# EAGLE board snc98_Display_15x7-Seg_3-digit_LTD056 (EAGLE 6.6.0), part 1 of 2
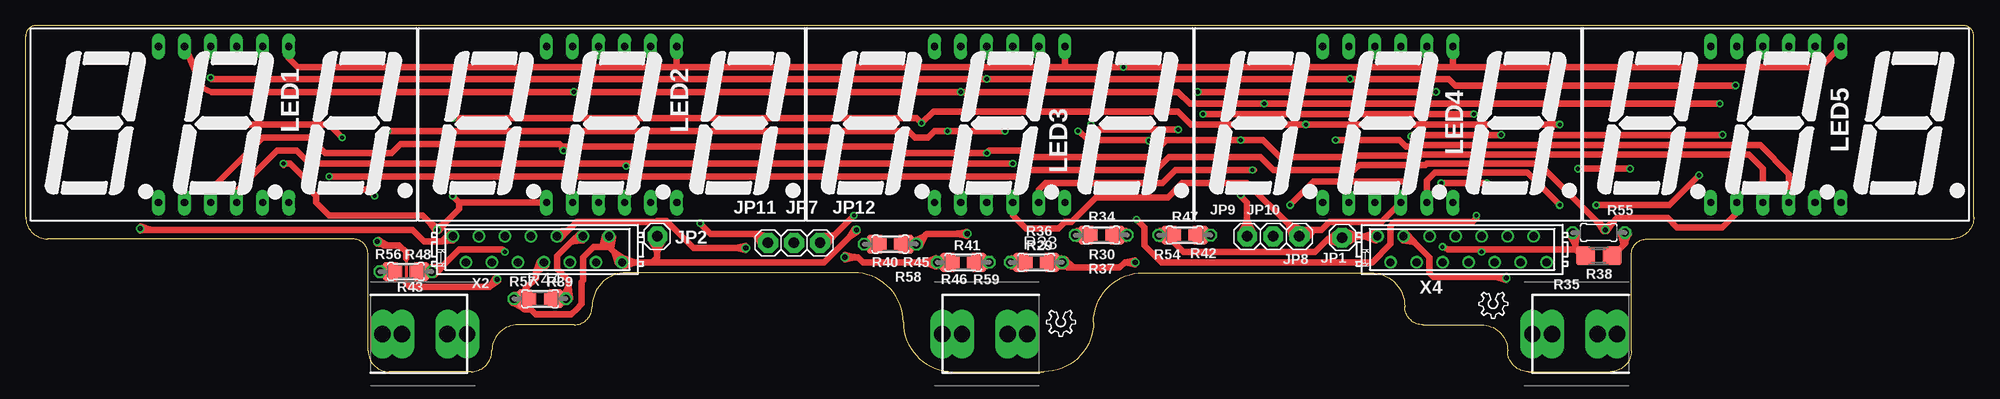
[diagram p2: board, top side]
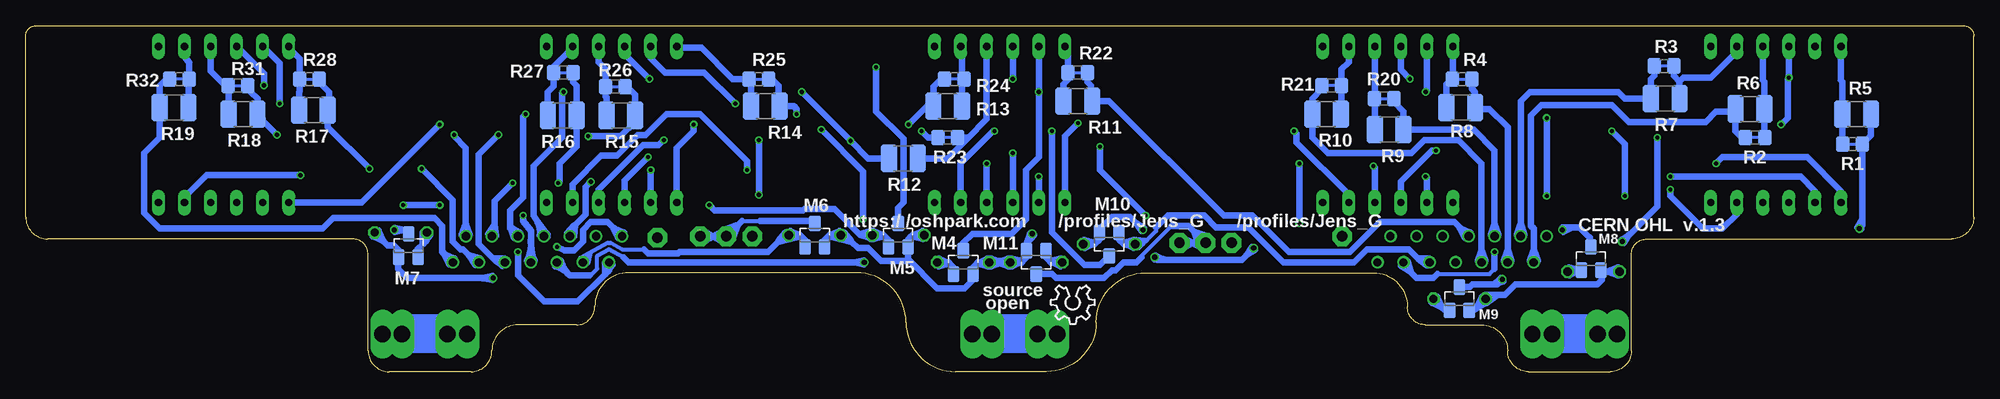
[diagram p3: board, bottom side, seen from below]

Size 189.99 x 33.78 mm. Coordinates in mm from the lower left corner, seen from the top.
Outline: 189.99,32.77 arc90 188.98,33.78 1.02,33.78 arc90 0,32.77 0,15.11 arc90 2.16,12.95 31.88,12.95 arc-90 33.4,11.43 33.4,2.03 arc90 35.43,0 43.43,0 arc90 45.47,2.03 arc-90 48.01,4.57 53.47,4.57 arc90 55.25,6.35 arc-90 58.55,9.65 80.77,9.65 arc-90 85.6,4.83 arc90 90.42,0 99.31,0 arc90 104.14,4.83 arc-90 108.97,9.65 131.19,9.65 arc-90 134.49,6.35 arc90 136.27,4.57 141.99,4.57 arc-90 144.53,2.03 arc90 146.56,0 154.56,0 arc90 156.59,2.03 156.59,11.43 arc-90 158.12,12.95 187.83,12.95 arc90 189.99,15.11 189.99,32.77
Copper layers (1*16): Top 0.035mm / dielectric 1.6mm / Bottom 0.035mm
Design rules "Elecrow_2-layer_PCB_eagle_rule": minimum track width 6mil, minimum drill 12mil, track to track 6mil, track to pad 6mil, pad to pad 6mil, via to via 8mil, smd to smd 0mil, copper to edge 20mil, drill to drill 10mil, minimum pad ring 6mil, minimum via ring 6mil, stop-mask expansion 0mil, vias tented up to drill 100mil, thermal gap 10mil

## Footprints (pad centres in the part's own frame; a part is rotated, then mirrored left to right if it is on the bottom)
BATTERY-AAA-LEFT = drill 1.6 long: P1 -2.413,0; P2 3.937,0; P3 2.032,0; P4 -4.318,0
BATTERY-AAA-RIGHT = drill 1.6 long: M1 -3.937,0; M2 2.413,0; M3 4.318,0; M4 -2.032,0
1X01 = drill 1.016 pad 1.93 octagon: 1 0,0
BX56-12 = drill 0.7 pad 1.27 long: 1 -6.35,-7.62; 2 -3.81,-7.62; 3 -1.27,-7.62; 4 1.27,-7.62; 5 3.81,-7.62; 6 6.35,-7.62; 7 6.35,7.62; 8 3.81,7.62; 9 1.27,7.62; 10 -1.27,7.62; 11 -3.81,7.62; 12 -6.35,7.62
SOT-23 = smd 1.143 x 1.524: 1 0.953,1.143; 2 -0.953,1.143; 3 0,-1.143
R0805 = smd 1.3 x 1.5: 1 -0.95,0; 2 0.95,0
R1210 = smd 1.6 x 2.7: 1 -1.4,0; 2 1.4,0
0204/5 = drill 0.813 octagon: 1 -2.54,0; 2 2.54,0
M0805 = smd 1.3 x 1.6: 1 -1.016,0; 2 1.016,0
R1206 = smd 1.6 x 1.803: 1 -1.422,0; 2 1.422,0
MICROMATCH-14 = drill 0.813: 1 8.255,-1.27; 2 6.985,1.27; 3 5.715,-1.27; 4 4.445,1.27; 5 3.175,-1.27; 6 1.905,1.27; 7 0.635,-1.27; 8 -0.635,1.27; 9 -1.905,-1.27; 10 -3.175,1.27; 11 -4.445,-1.27; 12 -5.715,1.27; 13 -6.985,-1.27; 14 -8.255,1.27

## Placement (x,y rotation side)
BH4  HOLDER_AAA_LEFT1  [BATTERY-AAA-LEFT]  151.26,3.68 0 top
BH5  HOLDER_AAA_LEFT1  [BATTERY-AAA-LEFT]  93.73,3.68 0 top
BH6  HOLDER_AAA_RIGHT  [BATTERY-AAA-RIGHT]  38.73,3.68 0 top
JP1  [1X01]  128.4,13.08 0 top
JP2  [1X01]  61.59,13.21 0 top
JP7  [1X01]  74.93,12.57 0 top
JP8  [1X01]  124.21,13.21 0 top
JP9  [1X01]  119.13,13.21 0 top
JP10  [1X01]  121.67,13.21 0 top
JP11  [1X01]  72.39,12.57 0 top
JP12  [1X01]  77.47,12.57 0 top
LED1  BC56-12SRWA  [BX56-12]  19.3,24.13 0 top
LED2  BC56-12SRWA  [BX56-12]  57.15,24.13 0 top
LED3  BC56-12SRWA  [BX56-12]  95,24.13 0 top
LED4  BC56-12SRWA  [BX56-12]  132.84,24.13 0 top
LED5  BC56-12SRWA  [BX56-12]  170.69,24.13 0 top
LOGO1  OSHW_LOGO_8MILX0150-NT  [OSHW_8X150_NOTEXT]  85.75,8.43 180 bottom
LOGO2  OSHW_LOGO_6MILX0100-NT  [OSHW_6X100_NOTEXT]  102.36,5.97 180 top
LOGO3  OSHW_LOGO_6MILX0100-NT  [OSHW_6X100_NOTEXT]  144.53,7.75 180 top
M4  IRLML2244  [SOT-23]  98.55,10.67 180 bottom
M5  IRLML2244  [SOT-23]  104.9,13.34 180 bottom
M6  IRLML2244  [SOT-23]  113.03,13.34 180 bottom
M7  IRLML2244  [SOT-23]  152.65,12.32 180 bottom
M8  IRLML2244  [SOT-23]  37.34,11.05 180 bottom
M9  IRLML2244  [SOT-23]  50.17,7.11 180 bottom
M10  IRLML2244  [SOT-23]  84.33,12.45 0 bottom
M11  IRLML2244  [SOT-23]  91.44,10.67 0 bottom
R1  22  [R0805]  11.81,22.23 0 bottom
R2  22  [R0805]  21.34,22.86 180 bottom
R3  22  [R0805]  30.23,29.84 180 bottom
R4  22  [R0805]  49.91,28.57 0 bottom
R5  22  [R1210]  11.43,25.15 0 bottom
R6  22  [R1210]  21.84,25.65 180 bottom
R7  22  [R1210]  30.1,26.67 180 bottom
R8  22  [R1210]  50.04,25.78 0 bottom
R9  22  [R1210]  57.02,23.62 0 bottom
R10  22  [R1210]  63.12,25.15 180 bottom
R11  22  [R1210]  87.38,26.42 0 bottom
R12  22  [R1210]  104.39,20.83 180 bottom
R13  22  [R1210]  100.08,25.91 180 bottom
R14  22  [R1210]  117.86,25.91 0 bottom
R15  22  [R1210]  131.95,25.02 0 bottom
R16  22  [R1210]  137.67,25.02 0 bottom
R17  22  [R1210]  161.93,25.53 0 bottom
R18  22  [R1210]  168.78,25.15 0 bottom
R19  22  [R1210]  175.51,25.78 180 bottom
R20  22  [R0805]  57.53,26.67 0 bottom
R21  22  [R0805]  62.61,27.94 180 bottom
R22  22  [R0805]  87.38,29.21 0 bottom
R23  22  [R0805]  100.08,22.86 180 bottom
R24  22  [R0805]  99.44,28.57 180 bottom
R25  22  [R0805]  118.49,28.57 0 bottom
R26  22  [R0805]  132.46,27.81 0 bottom
R27  22  [R0805]  137.54,29.21 0 bottom
R28  22  [R0805]  162.31,28.57 0 bottom
R29  3k3  [0204/5]  98.55,10.67 0 top
R30  3k3  [0204/5]  104.9,13.34 0 top
R31  22  [R0805]  169.29,27.94 0 bottom
R32  22  [R0805]  175.01,28.57 180 bottom
R33  3k3  [M0805]  98.55,10.67 0 top
R34  3k3  [M0805]  104.9,13.34 0 top
R35  3k3  [M0805]  153.42,11.3 0 top
R36  3k3  [R1206]  98.55,10.67 0 top
R37  3k3  [R1206]  104.9,13.34 0 top
R38  3k3  [R1206]  153.42,11.3 0 top
R39  3k3  [R1206]  50.17,7.11 0 top
R40  3k3  [R1206]  84.33,12.45 180 top
R41  3k3  [R1206]  91.44,10.67 180 top
R42  3k3  [R1206]  113.03,13.34 0 top
R43  3k3  [R1206]  37.08,9.78 0 top
R44  3k3  [M0805]  50.17,7.11 0 top
R45  3k3  [M0805]  84.33,12.45 180 top
R46  3k3  [M0805]  91.44,10.67 180 top
R47  3k3  [M0805]  113.03,13.34 0 top
R48  3k3  [M0805]  37.08,9.78 0 top
R54  3k3  [0204/5]  113.03,13.34 0 top
R55  3k3  [0204/5]  153.42,13.59 0 top
R56  3k3  [0204/5]  37.08,9.78 0 top
R57  3k3  [0204/5]  50.17,7.11 0 top
R58  3k3  [0204/5]  84.33,12.45 180 top
R59  3k3  [0204/5]  91.44,10.67 180 top
X2  MICROMATCH-14  [MICROMATCH-14]  49.91,11.94 180 top
X4  MICROMATCH-14  [MICROMATCH-14]  140.08,11.94 180 top

## Tracks (layer width: path | path; a pad name or v marks a point on that pad's centre or on a via)
CA_LED  (via drill 0.41, 0.51)
  Top 0.254: 49.28,7.62 48.84,7.21 48.76,7.13 | 48.76,7.13 R39.1 | R33.1 97.54,11.43 97.15,10.7 | 97.15,10.7 R36.1 | 103.5,13.3 103.89,12.7 R34.1 | 103.5,13.3 R37.1 | 97.15,10.7 arc-29 96.3,11.18 R29.1 96.33,10.18 arc-29 97.15,10.7 | 103.5,13.3 arc-29 102.67,13.83 R30.1 102.65,12.83 arc-29 103.5,13.3 | 48.76,7.13 arc-29 47.92,7.62 R57.1 47.93,6.62 arc-29 48.76,7.13
  Top 0.406: 53.72,6.22 53.72,6.1 | 124.84,11.81 124.84,11.68 | R47.1 111.63,13.34 | 111.63,13.34 111,13.34 111,13.35 111.14,13.49 | R35.1 R38.1 | R46.1 92.84,10.67 | 92.84,10.67 R59.1 | R45.1 85.73,12.45 | 85.73,12.45 R40.1 | R44.1 48.76,7.11 | 48.76,7.11 48.47,7.11 48.29,6.93 | R48.1 35.68,9.78 | 35.68,9.78 R56.1 | 111.63,13.34 arc-29 110.72,13.79 R54.1 110.72,12.88 arc-29 111.63,13.34 | 35.68,9.78 arc-29 34.77,10.23 R56.1 | 35.68,9.78 arc29 34.77,9.32 R56.1 | 48.76,7.11 arc-29 47.85,7.57 R57.1 47.85,6.66 arc-29 48.76,7.11 | 85.73,12.45 arc-29 86.64,11.99 R58.1 86.64,12.9 arc-29 85.73,12.45 | 92.84,10.67 arc-29 93.75,10.21 R59.1 | 92.84,10.67 arc29 93.75,11.12 R59.1
  Top 0.508: 47.76,7.55 48.84,7.21 48.76,7.17 | 48.76,7.17 48.29,6.93 47.83,6.7 | 47.76,7.55 arc29 48.76,7.23 arc29 47.85,6.71 R57.1 | R57.1 47.76,7.55 | 48.76,7.17 arc-29 47.79,7.54 R57.1 | 48.76,7.17 arc29 47.83,6.7 | R57.1 47.83,6.7
  Top 0.61: R43.1 R56.1 | 61.09,10.67 77.85,10.67 80.31,13.12 | 61.09,10.67 59.39,10.67 | 59.39,10.67 59.3,10.67 | 59.3,10.67 X2.14 | 80.31,13.12 80.34,13.16 | 80.34,13.16 v81.03,13.84 | R37.1 103.48,13.36 103.38,13.46 102.49,13.46 R30.1 | R54.1 111.23,13.31 R42.1 111.63,13.31 | 111.7,13.24 111.78,13.17 111.78,12.79 112.89,11.68 124.84,11.68 125.73,11.68 126.89,12.85 | 111.7,13.24 111.63,13.31 | 56.9,12.19 56.38,12.19 | 56.38,12.19 56.22,12.19 | 56.22,12.19 55.37,12.19 54.36,11.18 54.36,8.89 54.23,8.76 54.23,6.6 53.72,6.1 53.21,5.59 49.73,5.59 49.23,6.1 48.64,6.1 48.49,6.25 | X4.1 130.69,13.21 | 130.69,13.21 130.61,13.21 | 130.61,13.21 129.92,13.21 | 129.92,13.21 129.81,13.21 | 129.81,13.21 127.76,13.21 127.76,12.95 | JP2.1 61.59,11.79 | 61.59,11.79 61.59,11.68 | 61.59,11.68 61.59,11.18 61.09,10.67 | R58.1 R40.1 | R58.1 86.28,12.45 | 49.23,6.63 48.84,7.01 | 48.84,7.01 48.76,7.09 | 48.76,7.09 R39.1 | 48.64,7.21 R39.1 | R41.1 R59.1 | v91.82,13.46 90.86,13.46 | 90.86,13.46 90.8,13.46 | 90.8,13.46 87.88,13.46 87.73,13.31 | 87.73,13.31 87.67,13.25 | 87.67,13.25 R58.1 | R39.1 R57.1 | 48.49,6.25 48.43,6.31 | 48.43,6.31 R57.1 | v138.18,12.19 138.68,11.94 141.99,11.94 | 126.89,12.85 126.98,12.94 | 126.98,12.94 127,12.95 127.76,12.95 | 127.76,12.95 128.27,12.95 JP1.1 | X2.8 50.04,10.16 49.78,9.72 | 49.78,9.72 49.78,9.12 48.77,8.11 48.77,7.54 | 48.77,7.54 48.77,7.14 48.76,7.13 | 48.76,7.13 R39.1 | 141.99,11.94 151.13,11.94 | 151.13,11.94 151.38,11.68 151.61,11.68 R38.1 | 151.13,11.94 151.13,12.4 | 151.13,12.4 151.13,12.48 | 151.13,12.48 151.13,13.34 R55.1 | 56.9,12.19 X2.13 | X2.14 58.17,10.92 57.5,11.59 | 57.5,11.59 57.44,11.65 | 57.44,11.65 57.08,12 | 57.08,12 57.01,12.08
  Top 0.61: 57.01,12.08 56.9,12.19 | v141.99,11.68 141.99,11.94 | 80.31,13.12 80.35,13.15 | 80.35,13.15 81.14,13.67 | 80.31,13.12 80.34,13.17 | 80.34,13.17 80.86,13.96 | 90.8,13.46 90.86,13.45 | 90.86,13.45 91.78,13.26 | 90.8,13.46 91.78,13.66 | 111.7,13.24 111.14,13.49 110.66,13.71 | 111.7,13.24 111.62,13.21 | 111.62,13.21 110.59,12.94 | 151.13,12.4 151.14,12.48 | 151.14,12.48 151.28,13.54 | 151.13,12.4 151.09,12.47 | 151.09,12.47 150.53,13.38 | 49.78,9.72 50.76,10.32 | 49.78,9.72 50.16,10.8 | 130.61,13.21 131.69,12.82 | 130.61,13.21 130.69,13.24 | 130.69,13.24 131.69,13.59 | 59.39,10.67 59.3,10.7 | 59.3,10.7 58.3,11.05 | 59.39,10.67 58.3,10.29 | 57.44,11.65 57.78,10.55 | X2.14 57.78,10.55 | 57.44,11.65 58.39,11.01 | X2.14 58.39,11.01 | 56.22,12.19 56.29,12.24 | 56.29,12.24 57.14,12.88 | 56.22,12.19 56.24,12.28 | 56.24,12.28 56.5,13.31 | X2.13 56.5,13.31 | 57.08,12 57.1,12.09 | 57.1,12.09 57.3,13.13 | X2.13 57.3,13.13 | 57.08,12 57.04,12.08 | 57.04,12.08 56.54,13.02 | X2.13 56.54,13.02 | 129.92,13.21 129.81,13.25 | 129.81,13.25 128.63,13.7 | 128.63,13.7 | JP1.1 128.63,13.7 | 129.92,13.21 129.82,13.15 | 129.82,13.15 128.73,12.51 | 126.89,12.85 128.21,12.45 | 126.89,12.85 128.02,13.62 | 61.59,11.68 61.64,11.79 | 61.64,11.79 62.19,12.92 | JP2.1 62.19,12.92 | 61.59,11.68 61,12.92 | JP2.1 61,12.92 | 48.84,7.01 48.76,7.05 | 48.76,7.05 47.79,7.48 | 48.84,7.01 48.76,6.99 | 48.76,6.99 47.73,6.72 | 48.49,6.25 48.45,6.33 | 48.45,6.33 47.99,7.29 | 48.49,6.25 47.45,6.75 | 48.77,7.54 48.68,7.54 | 48.68,7.54 47.62,7.52 | 48.77,7.54 47.89,6.8 | 47.89,6.8 | R57.1 47.89,6.8 | 87.73,13.31 87.65,13.27 | 87.65,13.27 86.69,12.81 | 87.73,13.31 87.69,13.23 | 87.69,13.23 87.23,12.27 | 97.6,10.67 R33.1 97.15,10.67
  Top 0.61: 97.15,10.67 R36.1 R29.1 | 103.95,13.34 R34.1 103.5,13.34 | 103.5,13.34 R37.1 | R37.1 R30.1 | 80.34,13.16 arc-29 81.14,13.67 v81.03,13.84 | 80.34,13.16 arc29 80.86,13.95 v81.03,13.84 | 80.35,13.15 arc-29 81.14,13.67 | v81.03,13.84 81.14,13.67 | 80.35,13.15 arc29 80.85,13.95 v81.03,13.84 | 80.34,13.17 arc-29 81.13,13.67 v81.03,13.84 | 80.34,13.17 arc29 80.86,13.96 | v81.03,13.84 80.86,13.96 | 90.86,13.46 arc-29 91.78,13.26 v91.82,13.46 | 90.86,13.46 arc29 91.78,13.66 v91.82,13.46 | 90.86,13.45 arc-29 91.78,13.26 | v91.82,13.46 91.78,13.26 | 90.86,13.45 arc29 91.78,13.66 v91.82,13.46 | v91.82,13.46 91.78,13.26 arc29 90.86,13.47 arc29 91.78,13.66 | v91.82,13.46 91.78,13.66 | 97.15,10.67 arc-29 96.16,11.05 R29.1 | 97.15,10.67 arc29 96.16,10.29 R29.1 | 103.5,13.34 arc-29 102.51,13.71 R30.1 | 103.5,13.34 arc29 102.51,12.96 R30.1 | 111.63,13.31 arc-29 110.64,13.71 R54.1 | 111.63,13.31 arc29 110.63,12.95 R54.1 | 110.66,13.71 arc29 111.63,13.27 arc29 110.61,12.95 R54.1 | R54.1 110.66,13.71 | 111.62,13.21 arc-29 110.67,13.7 R54.1 | 111.62,13.21 arc29 110.59,12.94 | R54.1 110.59,12.94 | 151.13,12.48 arc-29 151.28,13.53 R55.1 | 151.13,12.48 arc29 150.54,13.36 R55.1 | 151.14,12.48 arc-29 151.28,13.54 | R55.1 151.28,13.54 | 151.14,12.48 arc29 150.54,13.36 R55.1 | 151.09,12.47 arc-29 151.28,13.52 R55.1 | 151.09,12.47 arc29 150.53,13.38 | R55.1 150.53,13.38 | X2.8 50.75,10.31 arc29 49.83,9.79 arc29 50.16,10.8 X2.8 | 50.76,10.32 arc29 49.86,9.76 arc29 50.16,10.78 X2.8 | X2.8 50.76,10.32 | X2.8 50.74,10.31 arc29 49.81,9.8 arc29 50.16,10.8 | X2.8 50.16,10.8 | 130.69,13.21 arc-29 131.68,12.83 X4.1 | 130.69,13.21 arc29 131.68,13.59 X4.1
  Top 0.61: 131.69,12.82 arc29 130.69,13.18 arc29 131.67,13.58 X4.1 | X4.1 131.69,12.82 | 130.69,13.24 arc-29 131.67,12.83 X4.1 | 130.69,13.24 arc29 131.69,13.59 | X4.1 131.69,13.59 | 59.3,10.67 arc-29 58.31,11.05 X2.14 | 59.3,10.67 arc29 58.31,10.29 X2.14 | 57.5,11.59 arc-29 57.77,10.56 X2.14 | 57.5,11.59 arc29 58.39,11.01 X2.14 | 59.3,10.7 arc-29 58.3,11.05 | X2.14 58.3,11.05 | 59.3,10.7 arc29 58.32,10.29 X2.14 | X2.14 58.32,11.04 arc29 59.3,10.64 arc29 58.3,10.29 | X2.14 58.3,10.29 | 57.78,10.55 arc29 57.47,11.56 arc29 58.38,11.02 X2.14 | X2.14 57.78,10.55 | X2.14 57.77,10.57 arc29 57.51,11.6 arc29 58.39,11.01 | X2.14 58.39,11.01 | 56.38,12.19 arc-29 57.17,12.91 X2.13 | 56.38,12.19 arc29 56.49,13.25 X2.13 | 57.01,12.08 arc-29 57.29,13.1 X2.13 | 57.01,12.08 arc29 56.53,13.03 X2.13 | 56.29,12.24 arc-29 57.14,12.88 | X2.13 57.14,12.88 | 56.29,12.24 arc29 56.5,13.29 X2.13 | 56.24,12.28 arc-29 57.12,12.87 X2.13 | 56.24,12.28 arc29 56.5,13.31 | X2.13 56.5,13.31 | 57.1,12.09 arc-29 57.3,13.13 | X2.13 57.3,13.13 | 57.1,12.09 arc29 56.55,13 X2.13 | 57.04,12.08 arc-29 57.29,13.11 X2.13 | 57.04,12.08 arc29 56.54,13.02 | X2.13 56.54,13.02 | 129.81,13.21 arc-29 128.65,13.69 JP1.1 | 129.81,13.21 arc29 128.75,12.53 JP1.1 | 126.98,12.94 arc-29 128.15,12.47 JP1.1 | 126.98,12.94 arc29 128.03,13.63 JP1.1 | 129.81,13.25 arc-29 128.63,13.7 | JP1.1 128.63,13.7 | 129.81,13.25 arc29 128.77,12.54 JP1.1 | 129.82,13.15 arc-29 128.68,13.68 JP1.1 | 129.82,13.15 arc29 128.73,12.51 | JP1.1 128.73,12.51 | 128.21,12.45 arc29 127,12.81 arc29 127.98,13.6 JP1.1 | JP1.1 128.21,12.45 | JP1.1 128.16,12.46 arc29 126.98,12.91 arc29 128.02,13.62 | JP1.1 128.02,13.62
  Top 0.61: 61.59,11.79 arc-29 62.18,12.9 JP2.1 | 61.59,11.79 arc29 61.01,12.9 JP2.1 | 61.64,11.79 arc-29 62.19,12.92 | JP2.1 62.19,12.92 | 61.64,11.79 arc29 61.02,12.88 JP2.1 | JP2.1 62.17,12.88 arc29 61.55,11.79 arc29 61,12.92 | JP2.1 61,12.92 | 48.76,7.09 arc-29 47.78,7.49 R57.1 | 48.76,7.09 arc29 47.76,6.73 R57.1 | 48.43,6.31 arc-29 48,7.28 R57.1 | 48.43,6.31 arc29 47.46,6.74 R57.1 | 48.76,7.13 arc-29 47.76,7.49 R57.1 | 48.76,7.13 arc29 47.78,6.74 R57.1 | 48.76,7.05 arc-29 47.79,7.48 | R57.1 47.79,7.48 | 48.76,7.05 arc29 47.75,6.72 R57.1 | 48.76,6.99 arc-29 47.81,7.47 R57.1 | 48.76,6.99 arc29 47.73,6.72 | R57.1 47.73,6.72 | 48.45,6.33 arc-29 47.99,7.29 | R57.1 47.99,7.29 | 48.45,6.33 arc29 47.47,6.74 R57.1 | R57.1 48,7.27 arc29 48.41,6.29 arc29 47.45,6.75 | R57.1 47.45,6.75 | 48.68,7.54 arc-29 47.62,7.52 | R57.1 47.62,7.52 | 48.68,7.54 arc29 47.9,6.81 R57.1 | R57.1 47.64,7.52 arc29 48.7,7.48 arc29 47.89,6.8 | R57.1 47.89,6.8 | 87.67,13.25 arc-29 86.7,12.82 R58.1 | 87.67,13.25 arc29 87.24,12.28 R58.1 | 87.65,13.27 arc-29 86.69,12.81 | R58.1 86.69,12.81 | 87.65,13.27 arc29 87.24,12.29 R58.1 | 87.69,13.23 arc-29 86.71,12.82 R58.1 | 87.69,13.23 arc29 87.23,12.27 | R58.1 87.23,12.27
  Bottom 0.254: M8.2 35.92,9.91 35.92,9.78
  Bottom 0.61: M8.2 36.27,9.7 36.27,8.94 36.7,8.51 44.7,8.51 45.72,7.49 46.47,7.49 | 46.47,7.49 46.55,7.49 | 46.55,7.49 47.24,7.49 R57.1 | 81.74,14.56 82.3,15.11 84.07,15.11 85.27,13.92 M10.2 85.27,12.93 85.65,12.54 | 81.74,14.56 81.71,14.53 | 81.71,14.53 v81.03,13.84 | 36.14,9.78 35.92,9.78 35.76,9.78 | 35.76,9.78 35.68,9.78 | 35.68,9.78 R56.1 | 97.23,10.57 97.61,10.19 M4.2 97.66,9.6 97.66,8.89 98.42,8.13 101.09,8.13 103.96,11 | 97.23,10.57 97.15,10.65 | 97.15,10.65 R36.1 R29.1 | 103.58,13.24 103.96,12.85 M5.2 103.96,12.31 103.96,11 | 103.58,13.24 103.5,13.31 | 103.5,13.31 R37.1 R30.1 | 111.45,13.28 R54.1 | 103.96,11 104.16,10.79 106.55,10.79 107.82,12.06 108.84,12.06 109.46,12.69 | R54.1 110.11,13.34 109.52,12.74 | 109.52,12.74 109.46,12.69 | v138.18,12.19 137.41,11.81 136.53,11.81 135.64,12.7 135.64,13.84 134.87,14.61 133.22,14.61 132.69,14.07 | v141.99,11.68 141.99,9.4 139.45,6.86 136.14,6.86 133.49,9.51 | R58.1 85.85,12.45 | M9.2 48.64,6.1 48.49,6.25 | 48.49,6.25 48.43,6.31 | 48.43,6.31 R57.1 | 85.65,12.54 85.73,12.47 | 85.73,12.47 R40.1 R58.1 | 92.77,10.77 92.38,11.15 M11.2 92.33,11.73 92.33,12.58 | 92.77,10.77 92.84,10.69 | 92.84,10.69 R41.1 R59.1 | 92.33,12.58 92.08,12.95 v91.82,13.46 | R59.1 94.79,10.67 | 94.79,10.67 94.87,10.67 | 94.87,10.67 95.12,10.67 | 95.12,10.67 95.2,10.67 | 95.2,10.67 R29.1 | X4.2 133.1,9.91 133.42,9.58 | 133.42,9.58 133.49,9.51 | 132.69,14.07 132.63,14.01 | 132.63,14.01 X4.1 | 151.64,11.3 M7.2 151.74,11.3 151.74,11.96 151.27,12.44 | M6.2 112.08,12.87 111.7,13.24 | 111.7,13.24 111.63,13.31 | 111.63,13.31 R42.1 R54.1 | 151.27,12.44 151.2,12.5 | 151.2,12.5 150.88,12.83 R55.1 | 81.74,14.56 80.91,14.01
  Bottom 0.61: 81.74,14.56 81.2,13.73 | 92.33,12.58 92.01,13.53 | v91.82,13.46 92.01,13.53 | 92.33,12.58 91.67,13.33 | v91.82,13.46 91.67,13.33 | 97.23,10.57 97.15,10.61 | 97.15,10.61 96.18,11.04 | 97.23,10.57 97.14,10.55 | 97.14,10.55 96.12,10.28 | 94.79,10.67 95.11,10.55 | 95.11,10.55 95.88,10.29 | 94.79,10.67 94.87,10.7 | 94.87,10.7 95.11,10.78 | 95.11,10.78 95.88,11.05 | 103.58,13.24 103.5,13.27 | 103.5,13.27 102.53,13.71 | 103.58,13.24 103.49,13.21 | 103.49,13.21 102.47,12.94 | 109.46,12.69 110.58,12.94 | R54.1 110.58,12.94 | 109.46,12.69 109.51,12.75 | 109.51,12.75 110.17,13.59 | R54.1 110.17,13.59 | 111.7,13.24 111.63,13.27 | 111.63,13.27 110.66,13.71 | 111.7,13.24 111.62,13.21 | 111.62,13.21 110.59,12.94 | 151.27,12.44 151.27,12.52 | 151.27,12.52 151.28,13.58 | R55.1 151.28,13.58 | 151.27,12.44 150.56,13.34 | R55.1 150.56,13.34 | 35.76,9.78 35.68,9.81 | 35.68,9.81 34.68,10.16 | 35.76,9.78 34.68,9.4 | 132.69,14.07 132.61,14.03 | 132.61,14.03 131.65,13.57 | 132.69,14.07 132.65,13.99 | 132.65,13.99 132.19,13.03 | 133.49,9.51 133.49,9.6 | 133.49,9.6 133.5,10.66 | X4.2 133.5,10.66 | 133.49,9.51 132.78,10.42 | X4.2 132.78,10.42 | 46.47,7.49 46.53,7.44 | 46.53,7.44 47.38,6.79 | 47.38,6.79 | R57.1 47.38,6.79 | 46.47,7.49 47.61,7.52 | 47.61,7.52 47.62,7.52 | 48.49,6.25 48.45,6.33 | 48.45,6.33 47.99,7.29 | 48.49,6.25 47.45,6.75 | 85.65,12.54 86.7,12.07 | 85.65,12.54 85.74,12.57 | 85.74,12.57 86.76,12.84 | 92.77,10.77 93.81,10.3 | 92.77,10.77 92.85,10.79 | 92.85,10.79 93.88,11.06 | 95.2,10.67 95.12,10.7 | 95.12,10.7 94.88,10.78 | 94.88,10.78 94.11,11.05 | 95.2,10.67 94.88,10.55 | 94.88,10.55 94.11,10.29 | 81.71,14.53 arc-29 80.92,14.01 v81.03,13.84 | 81.71,14.53 arc29 81.2,13.73 v81.03,13.84
  Bottom 0.61: 80.91,14.01 arc29 81.7,14.53 arc29 81.2,13.73 v81.03,13.84 | v81.03,13.84 80.91,14.01 | v81.03,13.84 80.92,14.02 arc29 81.72,14.52 arc29 81.2,13.73 | v81.03,13.84 81.2,13.73 | v91.82,13.46 92.02,13.52 arc29 92.3,12.62 arc29 91.67,13.33 v91.82,13.46 | 92.01,13.53 arc29 92.31,12.63 arc29 91.67,13.32 v91.82,13.46 | v91.82,13.46 92.01,13.53 | v91.82,13.46 92.02,13.52 arc29 92.3,12.62 arc29 91.67,13.33 | v91.82,13.46 91.67,13.33 | 97.15,10.65 arc-29 96.16,11.04 R29.1 | 97.15,10.65 arc29 96.15,10.29 R29.1 | 94.87,10.67 arc-29 95.87,10.29 R29.1 | 94.87,10.67 arc29 95.87,11.05 R29.1 | 97.15,10.61 arc-29 96.18,11.04 | R29.1 96.18,11.04 | 97.15,10.61 arc29 96.14,10.28 R29.1 | 97.14,10.55 arc-29 96.2,11.03 R29.1 | 97.14,10.55 arc29 96.12,10.28 | R29.1 96.12,10.28 | 95.88,10.29 arc29 94.87,10.64 arc29 95.86,11.04 R29.1 | R29.1 95.88,10.29 | 94.87,10.7 arc-29 95.86,10.29 R29.1 | 94.87,10.7 arc29 95.88,11.05 | R29.1 95.88,11.05 | 94.88,10.78 arc-29 95.83,10.3 R29.1 | 94.88,10.78 arc29 95.91,11.06 R29.1 | 94.88,10.55 arc-29 95.91,10.28 R29.1 | 94.88,10.55 arc29 95.83,11.03 R29.1 | 103.5,13.31 arc-29 102.51,13.71 R30.1 | 103.5,13.31 arc29 102.5,12.95 R30.1 | 103.5,13.27 arc-29 102.53,13.71 | R30.1 102.53,13.71 | 103.5,13.27 arc29 102.49,12.95 R30.1 | 103.49,13.21 arc-29 102.55,13.7 R30.1 | 103.49,13.21 arc29 102.47,12.94 | R30.1 102.47,12.94 | 109.52,12.74 arc-29 110.56,12.94 R54.1 | 109.52,12.74 arc29 110.17,13.58 R54.1 | 111.63,13.31 arc-29 110.64,13.71 R54.1 | 111.63,13.31 arc29 110.63,12.95 R54.1 | 110.58,12.94 arc29 109.54,12.7 arc29 110.16,13.57 R54.1 | R54.1 110.58,12.94 | 109.51,12.75 arc-29 110.56,12.94 R54.1
  Bottom 0.61: 109.51,12.75 arc29 110.17,13.59 | R54.1 110.17,13.59 | 111.63,13.27 arc-29 110.66,13.71 | R54.1 110.66,13.71 | 111.63,13.27 arc29 110.61,12.95 R54.1 | 111.62,13.21 arc-29 110.67,13.7 R54.1 | 111.62,13.21 arc29 110.59,12.94 | R54.1 110.59,12.94 | 151.2,12.5 arc-29 151.28,13.56 R55.1 | 151.2,12.5 arc29 150.55,13.34 R55.1 | 151.27,12.52 arc-29 151.28,13.58 | R55.1 151.28,13.58 | 151.27,12.52 arc29 150.57,13.32 R55.1 | R55.1 151.28,13.56 arc29 151.22,12.5 arc29 150.56,13.34 | R55.1 150.56,13.34 | 35.68,9.78 arc-29 34.69,10.16 R56.1 | 35.68,9.78 arc29 34.69,9.4 R56.1 | 35.68,9.81 arc-29 34.68,10.16 | R56.1 34.68,10.16 | 35.68,9.81 arc29 34.7,9.4 R56.1 | R56.1 34.7,10.15 arc29 35.68,9.75 arc29 34.68,9.4 | R56.1 34.68,9.4 | 132.63,14.01 arc-29 131.66,13.58 X4.1 | 132.63,14.01 arc29 132.2,13.04 X4.1 | 132.61,14.03 arc-29 131.65,13.57 | X4.1 131.65,13.57 | 132.61,14.03 arc29 132.2,13.05 X4.1 | 132.65,13.99 arc-29 131.67,13.58 X4.1 | 132.65,13.99 arc29 132.19,13.03 | X4.1 132.19,13.03 | 133.42,9.58 arc-29 133.5,10.64 X4.2 | 133.42,9.58 arc29 132.77,10.42 X4.2 | 133.49,9.6 arc-29 133.5,10.66 | X4.2 133.5,10.66 | 133.49,9.6 arc29 132.79,10.4 X4.2 | X4.2 133.5,10.64 arc29 133.44,9.58 arc29 132.78,10.42 | X4.2 132.78,10.42 | 46.55,7.49 arc-29 47.36,6.8 | R57.1 47.36,6.8 | 46.55,7.49 arc29 47.61,7.52 | R57.1 47.61,7.52 | 48.43,6.31 arc-29 48,7.28 R57.1 | 48.43,6.31 arc29 47.46,6.74 R57.1 | 46.53,7.44 arc-29 47.38,6.79 | R57.1 47.38,6.79 | 46.53,7.44 arc29 47.59,7.52 R57.1 | 47.36,6.8 arc29 46.55,7.5 arc29 47.62,7.52 | R57.1 47.36,6.8 | R57.1 47.62,7.52 | 48.45,6.33 arc-29 47.99,7.29 | R57.1 47.99,7.29 | 48.45,6.33 arc29 47.47,6.74 R57.1 | R57.1 48,7.27 arc29 48.41,6.29 arc29 47.45,6.75
  Bottom 0.61: R57.1 47.45,6.75 | 85.73,12.47 arc-29 86.72,12.07 R58.1 | 85.73,12.47 arc29 86.73,12.83 R58.1 | 86.7,12.07 arc29 85.73,12.51 arc29 86.74,12.83 R58.1 | R58.1 86.7,12.07 | 85.74,12.57 arc-29 86.68,12.08 R58.1 | 85.74,12.57 arc29 86.76,12.84 | R58.1 86.76,12.84 | 92.84,10.69 arc-29 93.83,10.29 R59.1 | 92.84,10.69 arc29 93.84,11.05 R59.1 | 95.12,10.67 arc-29 94.12,11.05 R59.1 | 95.12,10.67 arc29 94.12,10.29 R59.1 | 95.11,10.55 arc-29 94.16,11.03 R59.1 | 95.11,10.55 arc29 94.09,10.28 R59.1 | 95.11,10.78 arc-29 94.09,11.06 R59.1 | 95.11,10.78 arc29 94.16,10.3 R59.1 | 93.81,10.3 arc29 92.84,10.73 arc29 93.86,11.05 R59.1 | R59.1 93.81,10.3 | 92.85,10.79 arc-29 93.8,10.31 R59.1 | 92.85,10.79 arc29 93.88,11.06 | R59.1 93.88,11.06 | 95.12,10.7 arc-29 94.11,11.05 | R59.1 94.11,11.05 | 95.12,10.7 arc29 94.13,10.29 R59.1 | R59.1 94.13,11.04 arc29 95.12,10.64 arc29 94.11,10.29 | R59.1 94.11,10.29
D0_A  (via drill 0.51)
  Top 0.406: 41.4,12.95 41.53,12.95
  Top 0.61: 12.18,13.84 37.72,13.84 38.86,12.7 40.51,12.7 | 12.18,13.84 12.13,13.84 | 12.13,13.84 11.3,13.84 v11.18,13.97 | X2.1 41.78,13.21 41.53,12.95 40.51,12.7 | 40.55,12.7 40.51,12.7 | 12.18,13.84 11.24,14.16 | 11.24,14.16 | v11.18,13.97 11.24,14.16 | 12.18,13.84 12.13,13.84 | 12.13,13.84 11.19,13.77 | 40.55,12.7 41.69,12.8 | 40.55,12.7 40.61,12.76 | 40.61,12.76 41.37,13.5 | 12.13,13.84 arc-29 11.25,14.16 | v11.18,13.97 11.25,14.16 | 12.13,13.84 arc29 11.19,13.77 v11.18,13.97 | 11.24,14.16 arc29 12.13,13.86 arc29 11.2,13.77 v11.18,13.97 | v11.18,13.97 11.24,14.16 | 12.13,13.84 arc-29 11.25,14.16 | v11.18,13.97 11.25,14.16 | 12.13,13.84 arc29 11.19,13.77 | v11.18,13.97 11.19,13.77 | X2.1 41.69,12.8 arc29 40.62,12.73 arc29 41.36,13.49 X2.1 | 41.69,12.8 arc29 40.63,12.71 arc29 41.36,13.48 X2.1 | X2.1 41.69,12.8 | 40.61,12.76 arc-29 41.67,12.8 X2.1 | 40.61,12.76 arc29 41.37,13.5 | X2.1 41.37,13.5
  Bottom 0.61: R5.2 10.03,23.06 R1.2 10.86,14.94 | 10.86,14.94 10.86,14.88 | 10.86,14.88 10.86,14.29 v11.18,13.97 | 10.86,14.94 10.97,13.95 | 10.86,14.94 10.89,14.89 | 10.89,14.89 11.35,14.07 | 10.86,14.88 arc-29 10.97,13.95 v11.18,13.97 | 10.86,14.88 arc29 11.35,14.07 v11.18,13.97 | 10.97,13.95 arc29 10.87,14.88 arc29 11.35,14.07 v11.18,13.97 | v11.18,13.97 10.97,13.95 | 10.89,14.89 arc-29 10.97,13.95 v11.18,13.97 | 10.89,14.89 arc29 11.35,14.07 | v11.18,13.97 11.35,14.07
D1_A
  Bottom 0.61: 42.93,11.89 42.93,13.97 43.18,14.22 43.18,25.02 42.16,26.04 35.31,26.04 33.66,24.38 26.16,24.38 25.15,25.4 23.5,25.4 R6.2 23.24,25.02 23.24,23.5 22.61,22.86 R2.2 | 42.93,11.89 42.93,11.81 | 42.93,11.81 X2.2 | 42.93,11.89 42.54,10.8 | 42.93,11.89 42.95,11.81 | 42.95,11.81 43.31,10.8 | 42.93,11.81 arc-29 42.55,10.81 X2.2 | 42.93,11.81 arc29 43.31,10.81 X2.2 | 42.54,10.8 arc29 42.9,11.81 arc29 43.3,10.82 X2.2 | X2.2 42.54,10.8 | 42.95,11.81 arc-29 42.55,10.82 X2.2 | 42.95,11.81 arc29 43.31,10.8 | X2.2 43.31,10.8
D2_A
  Bottom 0.61: R7.2 31.5,26.03 | X2.3 44.2,14.35 | 44.2,14.35 44.2,14.43 | 44.2,14.43 44.2,26.42 43.31,27.3 34.67,27.3 34.04,26.67 R7.2 | R3.2 31.18,28.89 31.5,28.57 R7.2 | 44.2,14.43 43.81,13.34 | 44.2,14.43 44.23,14.35 | 44.23,14.35 44.58,13.34 | 44.2,14.35 arc-29 43.82,13.35 X2.3 | 44.2,14.35 arc29 44.58,13.35 X2.3 | 43.81,13.34 arc29 44.17,14.35 arc29 44.57,13.36 X2.3 | X2.3 43.81,13.34 | 44.23,14.35 arc-29 43.82,13.36 X2.3 | 44.23,14.35 arc29 44.58,13.34 | X2.3 44.58,13.34
D3_A
  Bottom 0.61: 45.47,11.89 45.47,23.88 47.24,25.65 48.51,25.65 R8.2 | 45.47,11.89 45.47,11.81 | 45.47,11.81 X2.4 | R8.2 48.64,25.4 | R4.2 48.96,27.62 48.64,27.3 R8.2 | 45.47,11.89 45.08,10.8 | 45.47,11.89 45.5,11.81 | 45.5,11.81 45.85,10.8 | 45.47,11.81 arc-29 45.09,10.81 X2.4 | 45.47,11.81 arc29 45.85,10.81 X2.4 | 45.08,10.8 arc29 45.44,11.81 arc29 45.84,10.82 X2.4 | X2.4 45.08,10.8 | 45.5,11.81 arc-29 45.09,10.82 X2.4 | 45.5,11.81 arc29 45.85,10.8 | X2.4 45.85,10.8
D4_A
  Bottom 0.61: X2.5 46.74,14.35 | 46.74,14.35 46.74,14.43 | 46.74,14.43 46.74,21.59 48.77,23.62 R9.2 55.63,25.4 56.58,26.36 R20.2 | 46.74,14.43 46.35,13.34 | 46.74,14.43 46.77,14.35 | 46.77,14.35 47.12,13.34 | 46.74,14.35 arc-29 46.36,13.35 X2.5 | 46.74,14.35 arc29 47.12,13.35 X2.5 | 46.35,13.34 arc29 46.71,14.35 arc29 47.11,13.36 X2.5 | X2.5 46.35,13.34 | 46.77,14.35 arc-29 46.36,13.36 X2.5 | 46.77,14.35 arc29 47.12,13.34 | X2.5 47.12,13.34
D5_A
  Bottom 0.61: X2.6 48.01,11.81 | 48.01,11.81 48.01,11.89 | 48.01,11.89 48.01,20.32 50.29,22.61 53.59,22.61 54.86,21.34 62.99,21.34 64.52,22.86 R10.2 64.52,26.67 63.56,27.62 R21.2 | 48.01,11.89 47.62,10.8 | 48.01,11.89 48.03,11.81 | 48.03,11.81 48.39,10.8 | 48.01,11.81 arc-29 47.63,10.81 X2.6 | 48.01,11.81 arc29 48.39,10.81 X2.6 | 47.62,10.8 arc29 47.98,11.81 arc29 48.38,10.82 X2.6 | X2.6 47.62,10.8 | 48.03,11.81 arc-29 47.63,10.82 X2.6 | 48.03,11.81 arc29 48.39,10.8 | X2.6 48.39,10.8
D6_A
  Bottom 0.61: R22.2 86.43,28.26 86.11,27.94 86.11,26.55 R11.2 84.33,26.42 73.15,15.24 70.36,15.24 66.8,11.68 60.83,11.68 57.91,14.61 50.67,14.61 50.14,14.07 | 50.14,14.07 50.08,14.01 | 50.08,14.01 X2.7 | 50.14,14.07 50.06,14.03 | 50.06,14.03 49.1,13.57 | 50.14,14.07 50.1,13.99 | 50.1,13.99 49.64,13.03 | 50.08,14.01 arc-29 49.11,13.58 X2.7 | 50.08,14.01 arc29 49.65,13.04 X2.7 | 50.06,14.03 arc-29 49.1,13.57 | X2.7 49.1,13.57 | 50.06,14.03 arc29 49.65,13.05 X2.7 | 50.1,13.99 arc-29 49.12,13.58 X2.7 | 50.1,13.99 arc29 49.64,13.03 | X2.7 49.64,13.03
D7_A  (via drill 0.41)
  Top 0.61: v137.54,27.3 v114.3,27.3 | v102.62,23.5 102.74,23.5 103.63,22.61 109.47,22.61 v109.54,22.54
  Bottom 0.61: v114.3,27.3 v109.54,22.54 107.82,20.83 R12.2 | R23.2 101.98,22.86 v102.62,23.5 | X4.7 139.19,13.46 140.07,14.59 | 140.07,14.59 140.46,15.24 140.46,20.07 137.67,22.86 137.67,27.18 v137.54,27.3 | X4.7 139.09,13.15 | X4.7 139.84,13.28 X4.7 | 140.07,14.59 arc-29 139.08,13.39 X4.7 | 140.07,14.59 arc29 139.84,13.31 X4.7 | X4.7 139.09,13.4 | X4.7 139.84,13.3 | X4.7 139.1,13.42
D8_A  (via drill 0.41)
  Top 0.61: v108.33,14.86 109.09,14.1 109.09,12.32 110.74,10.67 131.32,10.67 133.1,12.45 133.1,14.22 133.48,14.61 141.1,14.61 141.48,14.99 v141.48,15.24 | v112.39,23.62 104.39,23.62 v103.89,24.13
  Bottom 0.61: v108.33,14.86 108.33,19.56 v112.39,23.62 | v103.89,24.13 102.11,25.91 R13.2 101.48,27.81 100.71,28.57 R24.2 | X4.8 140.72,11.38 | 140.72,11.38 140.72,13.08 | 140.72,13.08 140.72,13.72 141.48,14.73 v141.48,15.24 | 140.72,11.38 140.33,10.8 | 140.72,11.38 140.75,11.55 | 140.75,11.55 141.1,10.8 | 140.72,13.08 arc-29 140.34,10.81 X4.8 | 140.72,13.08 arc29 141.1,10.81 X4.8 | 140.33,10.8 arc29 140.69,11.81 arc29 141.09,10.82 X4.8 | X4.8 140.33,10.8 | 140.75,11.55 arc-29 140.34,10.82 X4.8 | 140.75,11.55 arc29 141.1,10.8 | X4.8 141.1,10.8
D9_A  (via drill 0.41)
  Top 0.61: v141.22,25.15 v114.81,25.15
  Bottom 0.61: R14.2 116.46,25.78 | v114.81,25.15 114.81,25.65 115.06,25.91 R14.2 | R25.2 117.22,28.57 116.59,27.94 116.59,26.04 R14.2 | v141.22,25.15 141.48,24.89 141.48,17.02 142.75,15.75 142.75,14.16 | X4.9 142.75,13.97 142.75,14.05 | 142.75,14.16 142.75,14.05 | 142.75,14.16 142.67,14.11 | 142.67,14.11 141.77,13.55 | 142.75,14.16 142.72,14.08 | 142.72,14.08 142.37,13.07 | 142.75,14.05 arc-29 141.8,13.57 X4.9 | 142.75,14.05 arc29 142.37,13.06 X4.9 | 142.67,14.11 arc-29 141.77,13.55 | X4.9 141.77,13.55 | 142.67,14.11 arc29 142.38,13.09 X4.9 | 142.72,14.08 arc-29 141.79,13.56 X4.9 | 142.72,14.08 arc29 142.37,13.07 | X4.9 142.37,13.07
D10_A  (via drill 0.41)
  Top 0.61: v143.89,23.11 135.25,23.11 v135.13,22.99
  Bottom 0.61: R26.2 131.32,27.81 130.55,27.05 R15.2 130.55,24.39 131.95,22.99 v135.13,22.99 | X4.10 143.76,10.67 144.35,11 | 144.35,11 144.16,10.81 | 144.35,11 145.8,12.45 145.8,21.21 v143.89,23.11 | 144.16,10.81 144.32,11.06 | 144.32,11.06 143.26,11.07 | X4.10 143.26,11.07 | 144.16,10.81 143.51,10.35 | X4.10 143.51,10.35 | 144.35,11 arc-29 143.29,11.07 X4.10 | 144.35,11 arc29 143.5,10.35 X4.10 | 144.32,11.06 arc-29 143.26,11.07 | X4.10 143.26,11.07 | 144.32,11.06 arc29 143.52,10.36 X4.10 | X4.10 143.28,11.07 arc29 144.34,11.01 arc29 143.51,10.35 | X4.10 143.51,10.35
D11_A  (via drill 0.41)
  Top 0.61: v142.49,18.41 v138.05,18.41
  Bottom 0.61: R27.2 136.59,28.26 136.27,27.94 R16.2 | R16.2 | R16.2 136.27,21.97 137.92,20.32 137.92,18.54 v138.05,18.41 | v142.49,18.41 144.27,16.64 144.27,14.4 | 144.27,14.4 144.27,14.32 | 144.27,14.32 144.27,13.46 X4.11 | 144.27,14.4 144.26,14.31 | 144.26,14.31 144.12,13.26 | 144.27,14.4 144.32,14.33 | 144.32,14.33 144.87,13.42 | 144.27,14.32 arc-29 144.12,13.27 X4.11 | 144.27,14.32 arc29 144.86,13.43 X4.11 | 144.26,14.31 arc-29 144.12,13.26 | X4.11 144.12,13.26 | 144.26,14.31 arc29 144.86,13.44 X4.11 | 144.32,14.33 arc-29 144.13,13.28 X4.11 | 144.32,14.33 arc29 144.87,13.42 | X4.11 144.87,13.42
D12_A  (via drill 0.41)
  Top 0.61: v151.38,19.81 v156.46,19.81
  Bottom 0.61: R28.2 161.36,28.26 160.4,27.3 160.4,25.65 R17.2 160.53,23.87 v156.46,19.81 | X4.12 146.05,10.67 146.72,11.34 | 146.72,11.34 146.78,11.39 | 146.78,11.39 147.32,11.94 147.57,11.94 148.34,12.7 148.34,16.76 v151.38,19.81 | 146.78,11.39 146.69,11.37 | 146.69,11.37 145.68,11.06 | X4.12 145.68,11.06 | 146.78,11.39 146.13,10.44 | 146.72,11.34 arc-29 145.69,11.06 X4.12 | 146.72,11.34 arc29 146.14,10.45 X4.12 | 146.69,11.37 arc-29 145.68,11.06 | X4.12 145.68,11.06 | 146.69,11.37 arc29 146.14,10.46 X4.12 | X4.12 145.7,11.06 arc29 146.73,11.32 arc29 146.13,10.44 | X4.12 146.13,10.44
D13_A  (via drill 0.41)
  Top 0.61: v148.21,23.11 v165.48,23.11
  Bottom 0.61: R18.2 167.26,25.15 | 166.88,24.64 R18.2 | X4.13 147.07,14.35 | 147.07,14.35 147.07,14.43 | 147.07,14.43 147.07,21.84 148.21,22.99 v148.21,23.11 | R31.2 168.02,27.94 168.02,27.3 167.39,26.67 R18.2 | R18.2 167.39,24.77 167.13,24.77 v165.48,23.11 | 147.07,14.43 146.68,13.34 | 147.07,14.43 147.09,14.35 | 147.09,14.35 147.45,13.34 | 147.07,14.35 arc-29 146.69,13.35 X4.13 | 147.07,14.35 arc29 147.45,13.35 X4.13 | 146.68,13.34 arc29 147.04,14.35 arc29 147.44,13.36 X4.13 | X4.13 146.68,13.34 | 147.09,14.35 arc-29 146.69,13.36 X4.13 | 147.09,14.35 arc29 147.45,13.34 | X4.13 147.45,13.34
D14_A
  Bottom 0.61: R32.2 176.28,28.57 176.91,27.94 R19.2 176.91,22.86 178.44,21.34 178.44,15.49 176.91,13.97 161.04,13.97 160.02,14.99 150.11,14.99 149.35,14.22 149.35,11.68 149.2,11.53 | 149.2,11.53 149.14,11.47 | 149.14,11.47 X4.14 | 149.2,11.53 149.12,11.49 | 149.12,11.49 148.16,11.04 | 149.2,11.53 149.16,11.45 | 149.16,11.45 148.7,10.49 | 149.14,11.47 arc-29 148.17,11.04 X4.14 | 149.14,11.47 arc29 148.71,10.5 X4.14 | 149.12,11.49 arc-29 148.16,11.04 | X4.14 148.16,11.04 | 149.12,11.49 arc29 148.71,10.51 X4.14 | 149.16,11.45 arc-29 148.18,11.04 X4.14 | 149.16,11.45 arc29 148.7,10.49 | X4.14 148.7,10.49
DIG_0
  Bottom 0.61: LED1.12 12.95,28.45 12.83,28.32 R5.1 12.83,22.29 R1.1
DIG_1
  Bottom 0.61: LED1.9 20.57,28.45 20.44,28.32 R6.1 20.44,23.55 R2.1
DIG_2
  Bottom 0.61: R7.1 28.7,28.32 | 28.7,28.32 28.32,28.7 25.65,28.7 23.11,31.24 LED1.8 | R3.1 29.28,28.9 28.7,28.32
DIG_3
  Bottom 0.61: R8.1 51.44,28.06 51.05,28.45 50.8,28.83 | LED2.12 50.8,28.83 | R4.1 50.8,28.83
DIG_4
  Bottom 0.61: R9.1 58.42,25.4 58.42,25.65 58.42,26.48 | LED2.9 58.42,26.48 | 58.42,26.48 R20.1
DIG_5
  Bottom 0.61: R10.1 61.34,25.52 61.34,26.04 61.66,26.36 R21.1 61.66,29.52 60.96,30.23 LED2.8
DIG_6
  Bottom 0.61: R11.1 88.78,28.06 88.33,28.51 R22.1 88.33,31.43 LED3.12
DIG_7
  Bottom 0.61: 98.11,22.8 96.27,24.64 LED3.9 | 98.11,22.8 100.08,20.83 R12.1 | R23.1 98.17,22.86 98.11,22.8
DIG_8
  Bottom 0.61: R13.1 98.68,28.76 | 98.68,28.76 R24.1 | 98.68,28.76 98.68,31.62 LED3.8
DIG_9
  Bottom 0.61: R14.1 119.26,28.39 R25.1 | R25.1 119.44,28.25 119.38,28.19 | LED4.12 126.11,31.62 124.08,31.62 121.03,28.57 R25.1
DIG_10
  Bottom 0.61: R15.1 133.35,26.8 133.41,26.86 R26.1 133.41,29.52 134.11,30.23 LED4.9
DIG_11
  Bottom 0.61: R16.1 139.07,27.3 138.49,27.88 R27.1 138.49,29.78 136.65,31.62 LED4.8
DIG_12
  Bottom 0.61: 162.94,24.64 163.07,24.77 163.07,25.27 R17.1 163.33,27.3 163.26,27.37 R28.1 163.26,30.54 164.34,31.62 LED5.12
DIG_13
  Bottom 0.61: LED5.9 171.96,29.34 170.18,27.56 | R18.1 170.18,27.56 | 170.18,27.56 170.18,27.88 R31.1
DIG_14
  Bottom 0.61: R19.1 174.11,27.94 173.93,28.13 | 173.93,28.13 173.74,28.32 | LED5.8 174.5,30.73 174.06,30.16 R32.1 174.06,28.26 173.93,28.13
IO-A  (via drill 0.51)
  Top 0.254: R33.2 100.08,11.43 100.03,11.07 | 100.03,11.07 R36.2 | 100.03,11.07 arc-29 100.63,10.31 R29.2 100.99,11.24 arc-29 100.03,11.07
  Top 0.61: R29.2 R36.2 99.95,10.67 | v108.2,10.67 107.24,10.67 | 107.24,10.67 107.19,10.67 | 107.19,10.67 106.68,10.16 102.2,10.16 | 102.2,10.16 102.11,10.16 | 102.11,10.16 101.6,10.16 R29.2 | 107.19,10.67 107.24,10.66 | 107.24,10.66 108.16,10.47 | 107.19,10.67 108.16,10.87 | 102.2,10.16 102.14,10.22 | 102.14,10.22 101.38,10.96 | 102.2,10.16 101.05,10.26 | 99.5,10.67 R33.2 99.95,10.67 | 107.24,10.67 arc-29 108.16,10.47 v108.2,10.67 | 107.24,10.67 arc29 108.16,10.87 v108.2,10.67 | 107.24,10.66 arc-29 108.16,10.47 | v108.2,10.67 108.16,10.47 | 107.24,10.66 arc29 108.16,10.87 v108.2,10.67 | v108.2,10.67 108.16,10.47 arc29 107.24,10.68 arc29 108.16,10.87 | v108.2,10.67 108.16,10.87 | 102.11,10.16 arc-29 101.39,10.94 R29.2 | 102.11,10.16 arc29 101.05,10.26 R29.2 | 102.14,10.22 arc-29 101.38,10.96 | R29.2 101.38,10.96 | 102.14,10.22 arc29 101.08,10.26 R29.2 | R29.2 101.39,10.95 arc29 102.11,10.17 arc29 101.05,10.26 | R29.2 101.05,10.26 | 99.95,10.67 arc-29 100.95,10.29 R29.2 | 99.95,10.67 arc29 100.95,11.05 R29.2
  Bottom 0.406: 131.7,11.18 133.1,11.94 134.24,11.3 134.24,10.03 134.87,9.4 135,9.4
  Bottom 0.61: M4.1 99.49,10.19 99.88,10.57 | 99.88,10.57 99.95,10.65 | 99.95,10.65 R36.2 R29.2 | v108.2,10.67 109.17,10.67 | 109.17,10.67 109.22,10.67 | 109.22,10.67 131.19,10.67 131.7,11.18 | 135,9.4 136.91,9.4 137.12,9.61 | 137.12,9.61 137.57,10.06 | 137.57,10.06 X4.6 | 109.22,10.67 108.24,10.87 | 109.22,10.67 109.17,10.66 | 109.17,10.66 108.24,10.47 | 99.88,10.57 99.96,10.55 | 99.96,10.55 100.99,10.28 | 99.88,10.57 99.96,10.61 | 99.96,10.61 100.93,11.04 | 137.57,10.06 138.35,10.3 | 137.57,10.06 137.81,10.84 | 109.17,10.67 arc-29 108.25,10.87 v108.2,10.67 | 109.17,10.67 arc29 108.25,10.47 v108.2,10.67 | 108.24,10.87 arc29 109.17,10.68 arc29 108.25,10.47 v108.2,10.67 | v108.2,10.67 108.24,10.87 | 109.17,10.66 arc-29 108.25,10.87 v108.2,10.67 | 109.17,10.66 arc29 108.24,10.47 | v108.2,10.67 108.24,10.47 | 99.95,10.65 arc-29 100.95,10.29 R29.2 | 99.95,10.65 arc29 100.94,11.04 R29.2 | 99.96,10.55 arc-29 100.99,10.28 | R29.2 100.99,10.28 | 99.96,10.55 arc29 100.91,11.03 R29.2 | 99.96,10.61 arc-29 100.97,10.28 R29.2 | 99.96,10.61 arc29 100.93,11.04 | R29.2 100.93,11.04 | 137.12,9.61 arc-29 138.34,10.3 X4.6 | 137.12,9.61 arc29 137.81,10.83 X4.6 | 138.35,10.3 arc29 137.39,9.84 arc29 137.8,10.82 X4.6 | X4.6 138.35,10.3 | X4.6 138.33,10.29 arc29 137.35,9.88 arc29 137.81,10.84 | X4.6 137.81,10.84
IO-B  (via drill 0.41)
  Top 0.254: R34.2 106.43,13.97 R37.2 | 106.4,13.78 arc-29 106.97,12.99 R30.2 107.36,13.91 arc-29 106.4,13.78
  Top 0.61: v134.87,18.54 125.6,18.54 v123.32,16.26 | 105.85,13.34 R34.2 106.3,13.34 | 106.3,13.34 R37.2 R30.2 | 106.3,13.34 arc-29 107.3,12.96 R30.2 | 106.3,13.34 arc29 107.3,13.71 R30.2
  Bottom 0.61: M5.1 105.84,12.85 106.23,13.24 | 106.23,13.24 106.3,13.31 | 106.3,13.31 R37.2 R30.2 | R30.2 108.58,13.34 | 108.58,13.34 108.66,13.41 | 108.66,13.41 111.12,15.88 114.05,15.88 114.17,15.75 122.81,15.75 v123.32,16.26 | X4.5 136.91,13.84 136.48,14.27 | v134.87,18.54 135.38,18.03 135.38,15.37 136.42,14.33 | 136.42,14.33 136.48,14.27 | 106.23,13.24 106.31,13.21 | 106.31,13.21 107.34,12.94 | 106.23,13.24 106.31,13.27 | 106.31,13.27 107.28,13.71 | 108.66,13.41 108.58,13.43 | 108.58,13.43 107.55,13.73 | 108.66,13.41 108.58,13.38 | 108.58,13.38 107.6,12.96 | 136.42,14.33 136.5,13.18 | X4.5 136.5,13.18 | 136.42,14.33 136.48,14.26 | 136.48,14.26 137.2,13.48 | X4.5 137.2,13.48 | 106.3,13.31 arc-29 107.3,12.95 R30.2 | 106.3,13.31 arc29 107.29,13.71 R30.2 | 108.58,13.34 arc-29 107.59,13.71 R30.2 | 108.58,13.34 arc29 107.59,12.96 R30.2 | 106.31,13.21 arc-29 107.34,12.94 | R30.2 107.34,12.94 | 106.31,13.21 arc29 107.26,13.7 R30.2 | 106.31,13.27 arc-29 107.32,12.95 R30.2 | 106.31,13.27 arc29 107.28,13.71 | R30.2 107.28,13.71 | 108.58,13.43 arc-29 107.55,13.73 | R30.2 107.55,13.73 | 108.58,13.43 arc29 107.62,12.97 R30.2 | 108.58,13.38 arc-29 107.57,13.72 R30.2 | 108.58,13.38 arc29 107.6,12.96 | R30.2 107.6,12.96 | 136.48,14.27 arc-29 136.5,13.2 X4.5 | 136.48,14.27 arc29 137.21,13.48 X4.5 | 136.5,13.18 arc29 136.43,14.24 arc29 137.19,13.5 X4.5 | X4.5 136.5,13.18 | 136.48,14.26 arc-29 136.5,13.2 X4.5 | 136.48,14.26 arc29 137.2,13.48 | X4.5 137.2,13.48
IO-C
  Top 0.254: R47.2 114.05,13.97 114.43,13.37 | 114.43,13.37 R42.2 | 114.43,13.37 arc-29 115.26,12.84 R54.2 115.28,13.84 arc-29 114.43,13.37
  Top 0.406: R47.2 114.43,13.34 | 114.43,13.34 R42.2 114.77,13.34 115.05,13.05 | 114.43,13.34 arc-29 115.34,12.88 R54.2 115.34,13.79 arc-29 114.43,13.34
  Top 0.61: R42.2 115.09,13.31 R54.2
  Bottom 0.406: X4.4 135.51,11.3 133.22,12.57 132.97,12.57 131.83,11.94 129.67,11.94 | 135.14,10.55 134.88,11.62 135.87,11.12 | 135.14,10.55 | X4.4 135.13,10.59 arc29 134.98,11.6 arc29 135.88,11.12 X4.4 | 135.14,10.55 arc29 134.9,11.54 arc29 135.84,11.13 X4.4 | X4.4 135.14,10.55 | X4.4 135.13,10.58 arc29 134.96,11.58 arc29 135.87,11.12 | X4.4 135.87,11.12
  Bottom 0.61: 115.19,13.31 115.59,13.31 | R54.2 115.68,13.31 115.59,13.31 | 115.59,13.31 116.1,13.19 116.54,12.74 | 116.54,12.74 116.6,12.69 | 116.6,12.69 117.6,11.68 126.24,11.68 126.36,11.56 129.29,11.56 129.67,11.94 | M6.1 113.98,12.87 114.35,13.24 | 114.35,13.24 114.43,13.31 | 114.43,13.31 R42.2 R54.2 | 116.6,12.69 116.55,12.75 | 116.55,12.75 115.89,13.59 | R54.2 115.89,13.59 | 116.6,12.69 115.48,12.94 | R54.2 115.48,12.94 | 114.35,13.24 114.44,13.21 | 114.44,13.21 115.47,12.94 | 114.35,13.24 114.43,13.27 | 114.43,13.27 115.4,13.71 | X4.4 135.38,10.92 | 116.54,12.74 arc-29 115.89,13.58 R54.2 | 116.54,12.74 arc29 115.5,12.94 R54.2 | 114.43,13.31 arc-29 115.43,12.95 R54.2 | 114.43,13.31 arc29 115.42,13.71 R54.2 | 116.55,12.75 arc-29 115.89,13.59 | R54.2 115.89,13.59 | 116.55,12.75 arc29 115.5,12.94 R54.2 | R54.2 115.9,13.57 arc29 116.52,12.7 arc29 115.48,12.94 | R54.2 115.48,12.94 | 114.44,13.21 arc-29 115.47,12.94 | R54.2 115.47,12.94 | 114.44,13.21 arc29 115.39,13.7 R54.2 | 114.43,13.27 arc-29 115.45,12.95 R54.2 | 114.43,13.27 arc29 115.4,13.71 | R54.2 115.4,13.71
IO-D  (via drill 0.51 pad 0.25)
  Top 0.406: R35.2 R38.2
  Top 0.61: X4.3 134.87,13.21 135.38,12.7 | 143.39,9.27 137.29,9.27 136.91,9.65 136.91,11.18 135.44,12.64 | 143.39,9.27 143.44,9.27 | 143.44,9.27 144.27,9.27 v144.4,9.14 | R38.2 154.84,11.33 155.88,12.37 | 155.88,12.37 155.96,12.45 | 155.96,12.45 R55.2 | 135.44,12.64 135.38,12.7 | 143.39,9.27 143.44,9.25 | 143.44,9.25 144.33,8.95 | 144.33,8.95 | v144.4,9.14 144.33,8.95 | 143.39,9.27 144.38,9.35 | 155.88,12.37 156.33,13.43 | 155.88,12.37 155.56,13.48 | 135.44,12.64 135.38,12.7 | 135.38,12.7 134.67,13.48 | 134.67,13.48 134.66,13.48 | 135.44,12.64 135.36,12.65 | 135.36,12.65 134.31,12.81 | X4.3 134.31,12.81 | 143.44,9.27 arc-29 144.33,8.95 | v144.4,9.14 144.33,8.95 | 143.44,9.27 arc29 144.38,9.35 v144.4,9.14 | 143.44,9.25 arc-29 144.33,8.95 | v144.4,9.14 144.33,8.95 | 143.44,9.25 arc29 144.38,9.35 v144.4,9.14 | 144.33,8.95 arc29 143.44,9.28 arc29 144.38,9.35 | v144.4,9.14 144.33,8.95 | v144.4,9.14 144.38,9.35 | 155.96,12.45 arc-29 156.34,13.44 R55.2 | 155.96,12.45 arc29 155.58,13.44 R55.2 | 156.33,13.43 arc29 155.92,12.45 arc29 155.57,13.46 R55.2 | R55.2 156.33,13.43 | R55.2 156.32,13.41 arc29 155.86,12.46 arc29 155.56,13.48 | R55.2 155.56,13.48 | 135.38,12.7 arc-29 134.67,13.48 | X4.3 134.67,13.48 | 135.38,12.7 arc29 134.33,12.8 X4.3 | 135.38,12.7 arc-29 134.66,13.48 | X4.3 134.66,13.48 | 135.38,12.7 arc29 134.33,12.8 X4.3 | 135.36,12.65 arc-29 134.68,13.47 X4.3 | 135.36,12.65 arc29 134.31,12.81 | X4.3 134.31,12.81
  Bottom 0.61: 145.41,9.14 152.78,9.14 153.67,10.03 153.67,10.72 153.72,11.3 M7.1 153.61,11.87 154.05,12.32 154.69,12.32 155.09,12.73 | 145.41,9.14 145.36,9.14 | 145.36,9.14 v144.4,9.14 | 155.83,13.46 R55.2 | 155.09,12.73 155.15,12.78 | 155.15,12.78 R55.2 | 145.41,9.14 144.44,9.34 | 145.41,9.14 145.62,9.13 | 145.62,9.13 144.44,8.95 | 155.09,12.73 156.13,13.22 | 155.09,12.73 155.59,13.76 | 145.36,9.14 arc-29 144.44,9.34 v144.4,9.14 | 145.36,9.14 arc29 144.44,8.95 v144.4,9.14 | 144.44,9.34 arc29 145.36,9.15 arc29 144.44,8.95 v144.4,9.14 | v144.4,9.14 144.44,9.34 | 145.62,9.13 arc-29 144.44,9.34 v144.4,9.14 | 145.62,9.13 arc29 144.44,8.95 | v144.4,9.14 144.44,8.95 | 155.15,12.78 arc-29 156.12,13.22 R55.2 | 155.15,12.78 arc29 155.59,13.76 R55.2 | 156.13,13.22 arc29 155.17,12.76 arc29 155.58,13.74 R55.2 | R55.2 156.13,13.22 | R55.2 156.11,13.21 arc29 155.13,12.8 arc29 155.59,13.76 | R55.2 155.59,13.76
IO-DP  (via drill 0.51, 0.51 pad 0.25)
  Top 0.406: 61.59,14.73 60.71,14.73 60.58,14.61 | R41.2 90.04,10.67 | 90.04,10.67 R46.2 | 90.04,10.67 arc-29 89.13,11.12 R59.2 89.13,10.21 arc-29 90.04,10.67
  Top 0.61: R41.2 R59.2 | v79.88,11.18 80.85,11.18 | 80.85,11.18 80.9,11.18 | 80.9,11.18 81.15,11.18 81.66,10.67 87.68,10.67 | 87.68,10.67 87.76,10.67 | 87.76,10.67 R59.2 | v70.23,12.06 69.27,12.06 | 69.27,12.06 69.22,12.06 | 69.22,12.06 65.15,12.06 62.48,14.73 61.59,14.73 | 60.58,14.61 53.72,14.61 52.89,13.78 | 52.89,13.78 52.83,13.72 | 52.83,13.72 52.32,13.72 X2.9 | 80.9,11.18 79.92,11.38 | 80.9,11.18 80.85,11.17 | 80.85,11.17 79.92,10.98 | 69.22,12.06 69.27,12.05 | 69.27,12.05 70.19,11.87 | 69.22,12.06 70.19,12.26 | 87.68,10.67 88.77,10.29 | 87.68,10.67 87.76,10.7 | 87.76,10.7 88.77,11.05 | 52.89,13.78 51.76,13.61 | X2.9 51.76,13.61 | 52.89,13.78 52.83,13.71 | 52.83,13.71 52.12,12.93 | 52.12,12.93 52.11,12.93 | 80.85,11.18 arc-29 79.93,11.38 v79.88,11.18 | 80.85,11.18 arc29 79.93,10.98 v79.88,11.18 | 79.92,11.38 arc29 80.85,11.19 arc29 79.93,10.98 v79.88,11.18 | v79.88,11.18 79.92,11.38 | 80.85,11.17 arc-29 79.93,11.37 v79.88,11.18 | 80.85,11.17 arc29 79.92,10.98 | v79.88,11.18 79.92,10.98 | 69.27,12.06 arc-29 70.19,11.87 v70.23,12.06 | 69.27,12.06 arc29 70.19,12.26 v70.23,12.06 | 69.27,12.05 arc-29 70.19,11.87 | v70.23,12.06 70.19,11.87 | 69.27,12.05 arc29 70.19,12.26 v70.23,12.06 | v70.23,12.06 70.19,11.87 arc29 69.27,12.07 arc29 70.19,12.26 | v70.23,12.06 70.19,12.26 | 87.76,10.67 arc-29 88.75,10.29 R59.2 | 87.76,10.67 arc29 88.75,11.05 R59.2 | 88.77,10.29 arc29 87.76,10.64 arc29 88.74,11.04 R59.2 | R59.2 88.77,10.29 | 87.76,10.7 arc-29 88.74,10.29 R59.2 | 87.76,10.7 arc29 88.77,11.05 | R59.2 88.77,11.05 | 52.83,13.72 arc-29 51.78,13.61 X2.9 | 52.83,13.72 arc29 52.12,12.93 | X2.9 52.12,12.93 | 51.76,13.61 arc29 52.81,13.77 arc29 52.13,12.95 X2.9
  Top 0.61: X2.9 51.76,13.61 | 52.83,13.71 arc-29 51.78,13.61 X2.9 | 52.83,13.71 arc29 52.11,12.93 | X2.9 52.11,12.93
  Bottom 0.61: R59.2 R41.2 90.04,10.69 | v79.88,11.18 79.63,10.92 78.95,10.92 | 78.95,10.92 78.9,10.92 | 78.9,10.92 71.37,10.92 70.95,11.35 | 70.95,11.35 70.91,11.38 | 70.91,11.38 v70.23,12.06 | M11.1 90.49,11.14 90.11,10.77 | 90.11,10.77 90.04,10.69 | 78.9,10.92 78.95,10.93 | 78.95,10.93 79.89,10.97 | v79.88,11.18 79.89,10.97 | 78.9,10.92 78.95,10.95 | 78.95,10.95 79.79,11.36 | v79.88,11.18 79.79,11.36 | 70.95,11.35 70.4,12.18 | 70.95,11.35 70.91,11.38 | 70.91,11.38 70.12,11.89 | 90.11,10.77 90.03,10.79 | 90.03,10.79 89,11.06 | 90.11,10.77 89.07,10.3 | 78.95,10.92 arc-29 79.89,10.97 v79.88,11.18 | 78.95,10.92 arc29 79.79,11.36 v79.88,11.18 | 78.95,10.93 arc-29 79.89,10.97 | v79.88,11.18 79.89,10.97 | 78.95,10.93 arc29 79.79,11.36 v79.88,11.18 | 78.95,10.95 arc-29 79.89,10.97 v79.88,11.18 | 78.95,10.95 arc29 79.79,11.36 | v79.88,11.18 79.79,11.36 | 70.91,11.38 arc-29 70.4,12.18 v70.23,12.06 | 70.91,11.38 arc29 70.12,11.89 v70.23,12.06 | 70.4,12.18 arc29 70.92,11.39 arc29 70.12,11.89 v70.23,12.06 | v70.23,12.06 70.4,12.18 | 70.91,11.38 arc-29 70.4,12.17 v70.23,12.06 | 70.91,11.38 arc29 70.12,11.89 | v70.23,12.06 70.12,11.89 | 90.04,10.69 arc-29 89.04,11.05 R59.2 | 90.04,10.69 arc29 89.05,10.29 R59.2 | 90.03,10.79 arc-29 89,11.06 | R59.2 89,11.06 | 90.03,10.79 arc29 89.08,10.31 R59.2 | R59.2 89.02,11.05 arc29 90.04,10.73 arc29 89.07,10.3 | R59.2 89.07,10.3
IO-E  (via drill 0.4)
  Top 0.254: R48.2 37.85,10.16 38.49,9.79 | 38.49,9.79 R43.2 | 38.49,9.79 arc-29 39.32,9.28 R56.2 39.33,10.28 arc-29 38.49,9.79
  Top 0.61: R56.2 R43.2 | v46.74,11.68 46.48,11.94 42.29,11.94 40.7,10.35 | R56.2 40,9.91 40.26,9.91 40.64,10.29 | 40.7,10.35 40.64,10.29 | 40.7,10.35 39.56,10.18 | R56.2 39.56,10.18 | 40.7,10.35 40.64,10.29 | 40.64,10.29 39.92,9.51 | 39.92,9.51 39.92,9.5 | 40.64,10.29 arc-29 39.58,10.18 R56.2 | 40.64,10.29 arc29 39.92,9.51 | R56.2 39.92,9.51 | 39.56,10.18 arc29 40.62,10.34 arc29 39.94,9.52 R56.2 | R56.2 39.56,10.18 | 40.64,10.29 arc-29 39.59,10.18 R56.2 | 40.64,10.29 arc29 39.92,9.5 | R56.2 39.92,9.5
  Bottom 0.406: 52.32,9.53 47.24,9.53 46.74,10.03
  Bottom 0.61: R56.2 38.79,9.78 38.41,9.88 | 52.32,9.53 52.7,9.14 54.36,9.14 54.9,9.69 | 38.41,9.88 M8.1 | 46.74,10.03 v46.74,11.68 | X2.12 55.63,10.41 54.96,9.75 | 54.96,9.75 54.9,9.69 | 38.41,9.88 38.49,9.84 | 38.49,9.84 39.46,9.41 | 38.41,9.88 39.52,10.17 | 54.9,9.69 54.97,9.74 | 54.97,9.74 55.85,10.33 | 54.9,9.69 55.24,10.79 | X2.12 55.24,10.79 | R56.2 39.45,9.41 arc29 38.49,9.86 arc29 39.5,10.17 R56.2 | 38.49,9.84 arc-29 39.46,9.41 | R56.2 39.46,9.41 | 38.49,9.84 arc29 39.5,10.17 R56.2 | R56.2 39.44,9.42 arc29 38.49,9.9 arc29 39.52,10.17 | R56.2 39.52,10.17 | 54.96,9.75 arc-29 55.85,10.33 X2.12 | 54.96,9.75 arc29 55.23,10.77 X2.12 | 54.97,9.74 arc-29 55.85,10.33 | X2.12 55.85,10.33 | 54.97,9.74 arc29 55.23,10.77 X2.12 | X2.12 55.84,10.32 arc29 54.93,9.77 arc29 55.24,10.79 | X2.12 55.24,10.79
IO-F
  Top 0.406: R44.2 51.57,7.11 | 51.57,7.11 52.2,7.11 | 51.57,7.11 arc-29 52.48,6.66 R57.2 52.48,7.57 arc-29 51.57,7.11
  Top 0.61: R57.2 52.2,7.11 R39.2 | 52.96,8.3 52.96,8.89 51.82,10.03 51.82,11.3 53.24,12.72 | 52.96,8.3 52.96,8.22 | 52.96,8.22 52.96,7.37 R57.2 | X2.11 53.97,13.21 53.24,12.72 | 52.96,8.3 52.91,8.23 | 52.91,8.23 52.36,7.32 | 52.96,8.3 52.97,8.22 | 52.97,8.22 53.11,7.17 | 53.24,12.72 54.38,12.8 | X2.11 54.38,12.8 | 53.24,12.72 53.3,12.78 | 53.3,12.78 54.08,13.51 | X2.11 54.08,13.51 | 52.96,8.22 arc-29 52.37,7.34 R57.2 | 52.96,8.22 arc29 53.11,7.17 R57.2 | 52.91,8.23 arc-29 52.36,7.32 | R57.2 52.36,7.32 | 52.91,8.23 arc29 53.11,7.18 R57.2 | 52.97,8.22 arc-29 52.37,7.34 R57.2 | 52.97,8.22 arc29 53.11,7.17 | R57.2 53.11,7.17 | X2.11 54.37,12.8 arc29 53.31,12.77 arc29 54.08,13.5 X2.11 | 54.38,12.8 arc29 53.32,12.73 arc29 54.06,13.49 X2.11 | X2.11 54.38,12.8 | 53.3,12.78 arc-29 54.36,12.8 X2.11 | 53.3,12.78 arc29 54.08,13.51 | X2.11 54.08,13.51
  Bottom 0.61: M9.1 51.69,6.1 51.84,6.25 | 51.84,6.25 51.9,6.31 | 51.9,6.31 R57.2 | 51.84,6.25 52.88,6.75 | 51.84,6.25 52.34,7.29 | 51.9,6.31 arc-29 52.87,6.74 R57.2 | 51.9,6.31 arc29 52.33,7.28 R57.2 | 52.88,6.75 arc29 51.92,6.29 arc29 52.33,7.27 R57.2 | R57.2 52.88,6.75 | R57.2 52.86,6.74 arc29 51.88,6.33 arc29 52.34,7.29 | R57.2 52.34,7.29
IO-G
  Top 0.406: R45.2 82.93,12.45 | 82.93,12.45 R40.2 | 82.93,12.45 arc-29 82.02,12.9 R58.2 82.02,11.99 arc-29 82.93,12.45
  Top 0.61: R40.2 R58.2
  Bottom 0.406: R58.2 81.03,12.45 80.7,12.77 | 79.76,14.1 79.76,13.72 80.63,12.84 | 80.63,12.84 80.7,12.77 | 80.63,12.84 81.44,12.08 | 80.63,12.84 80.72,12.85 | 80.72,12.85 81.74,12.95 | R58.2 81.74,12.95 | 80.7,12.77 arc-29 81.44,12.08 R58.2 | 80.7,12.77 arc29 81.7,12.95 R58.2 | 81.44,12.08 arc29 80.7,12.78 arc29 81.7,12.95 R58.2 | R58.2 81.44,12.08 | 80.72,12.85 arc-29 81.42,12.1 R58.2 | 80.72,12.85 arc29 81.74,12.95 | R58.2 81.74,12.95